# EAGLE design main (EAGLE 6.1)
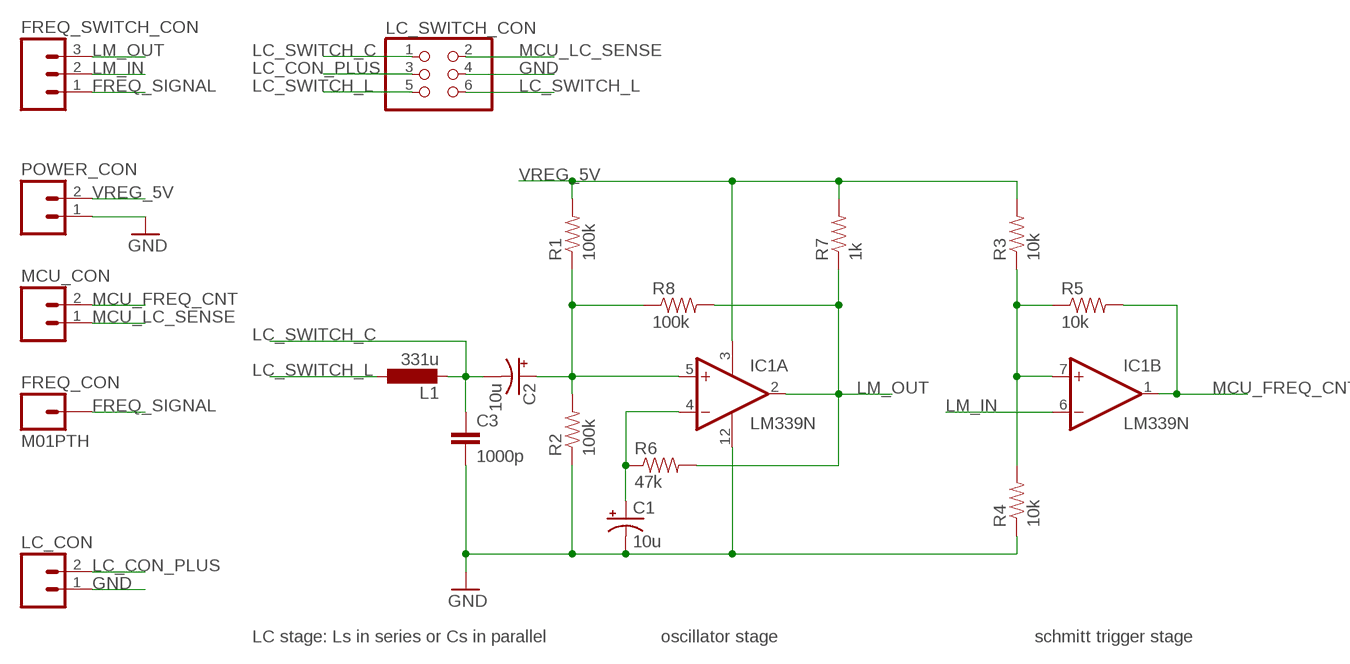
[diagram p0: schematic, sheet 1]

## Parts
C1  10u  CAP_POLPTH1  [CPOL-RADIAL-100UF-25V]
C2  10u  CAP_POLPTH1  [CPOL-RADIAL-100UF-25V]
C3  1000p  CAPKIT  [CAP-PTH-SMALL-KIT]
FREQ_CON  M01PTH  [1X01]
FREQ_SWITCH_CON  M03PTH  [1X03]
IC1  LM339N  [DIL14]
L1  331u  L-EU0207/10  [0207/10]
LC_CON  M02PTH  [1X02]
LC_SWITCH_CON  PINHD-2X3  [2X03]
MCU_CON  M02PTH  [1X02]
POWER_CON  M02PTH  [1X02]
R1  100k  RESISTORPTH-1/4W  [AXIAL-0.4]
R2  100k  RESISTORPTH-1/4W  [AXIAL-0.4]
R3  10k  RESISTORPTH-1/4W  [AXIAL-0.4]
R4  10k  RESISTORPTH-1/4W  [AXIAL-0.4]
R5  10k  RESISTORPTH-1/4W  [AXIAL-0.4]
R6  47k  RESISTORPTH-1/4W  [AXIAL-0.4]
R7  1k  RESISTORPTH-1/4W  [AXIAL-0.4]
R8  100k  RESISTORPTH-1/4W  [AXIAL-0.4]

## Nets
FREQ_SIGNAL: FREQ_CON.1 FREQ_SWITCH_CON.1
GND: C1.2(-) C3.2 IC1.12(P:GND) LC_CON.1 LC_SWITCH_CON.4 POWER_CON.1 R2.P$1 R4.P$1
LC_CON_PLUS: LC_CON.2 LC_SWITCH_CON.3
LC_SWITCH_C: C2.2(-) C3.1 L1.2 LC_SWITCH_CON.1
LC_SWITCH_L: L1.1 LC_SWITCH_CON.5 LC_SWITCH_CON.6
LM_IN: FREQ_SWITCH_CON.2 IC1.6(B:-IN)
LM_OUT: FREQ_SWITCH_CON.3 IC1.2(A:OUT) R6.P$2 R7.P$1 R8.P$2
MCU_FREQ_CNT: IC1.1(B:OUT) MCU_CON.2 R5.P$2
MCU_LC_SENSE: LC_SWITCH_CON.2 MCU_CON.1
N$2: C2.1(+) IC1.5(A:+IN) R1.P$1 R2.P$2 R8.P$1
N$5: C1.1(+) IC1.4(A:-IN) R6.P$1
N$6: IC1.7(B:+IN) R3.P$1 R4.P$2 R5.P$1
VREG_5V: IC1.3(P:V+) POWER_CON.2 R1.P$2 R3.P$2 R7.P$2
Unconnected: IC1.8(C:-IN) IC1.9(C:+IN) IC1.10(D:-IN) IC1.11(D:+IN) IC1.13(D:OUT) IC1.14(C:OUT)

## Notes on the sheet
- LC stage: Ls in series or Cs in parallel | oscillator stage | schmitt trigger stage

## Library data of the parts
C1 C2 = SparkFun:CAP_POL: Capacitor Polarized These are standard SMD and PTH capacitors. Normally 10uF, 47uF, and 100uF in electrolytic and tantalum varieties. Always verify the external diameter of the through hole cap, it varies with capacity, voltage, and manufacturer. The EIA devices should be standard.
C3 = SparkFun:CAP: Capacitor Standard 0603 ceramic capacitor, and 0.1" leaded capacitor.
FREQ_CON = SparkFun:M01: Header 1 Standard 1-pin 0.1" header. Use with straight break away headers (SKU : PRT-00116), right angle break away headers (PRT-00553), swiss pins (PRT-00743), machine pins (PRT-00117), and female headers (PRT-00115).
FREQ_SWITCH_CON = SparkFun:M03: Header 3 Standard 3-pin 0.1" header. Use with straight break away headers (SKU : PRT-00116), right angle break away headers (PRT-00553), swiss pins (PRT-00743), machine pins (PRT-00117), and female headers (PRT-00115). Molex polarized connector foot print use with SKU : PRT-08232 with associated crimp pins and housings.
IC1 = linear:LM339: Low Power Low Offset Voltage Quad Comparators with open collector; LM139/LM239/LM339/LM2901/LM3302
L1 = rcl:L-EU: INDUCTOR, European symbol
LC_CON MCU_CON POWER_CON = SparkFun:M02: Header 2 Standard 2-pin 0.1" header. Use with straight break away headers (SKU : PRT-00116), right angle break away headers (PRT-00553), swiss pins (PRT-00743), machine pins (PRT-00117), and female headers (PRT-00115). Molex polarized connector foot print use with SKU : PRT-08233 with associated crimp pins and housings.
LC_SWITCH_CON = SparkFun:PINHD-2X3: PIN HEADER
R1-R8 = SparkFun:RESISTOR: Resistor Basic schematic elements and footprints for 0603, 1206, and PTH resistors.

## Board
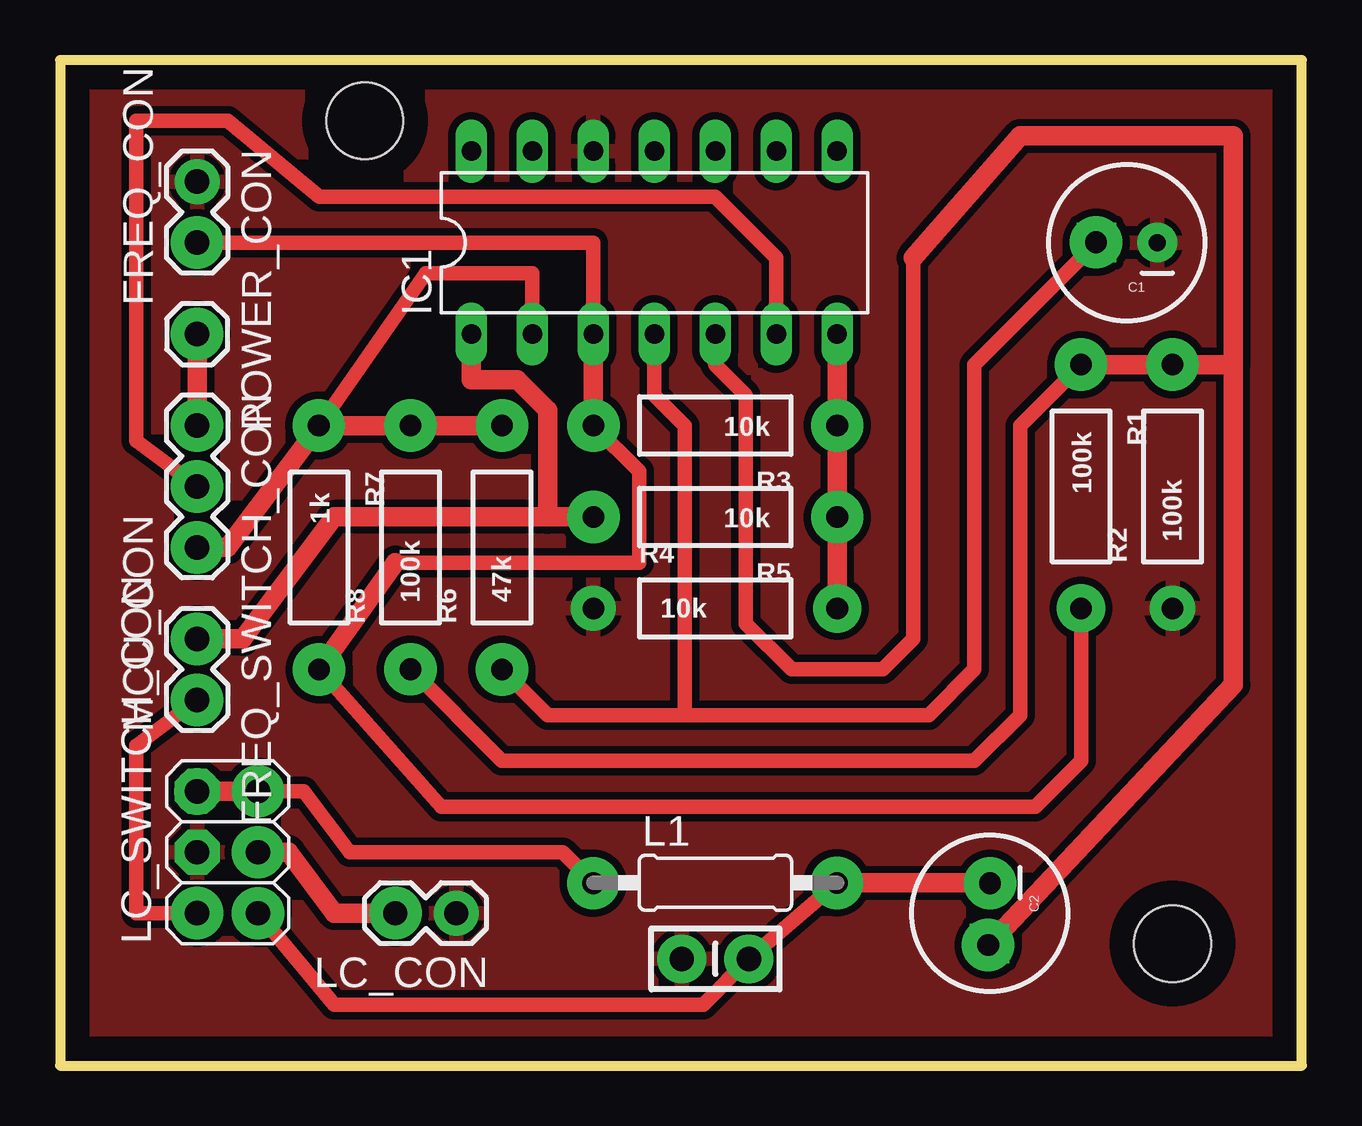
[diagram p1: board, top side]

Size 51.74 x 41.9 mm. Coordinates in mm from the lower left corner, seen from the top.
Outline: 0,0 51.74,0 51.74,41.9 0,41.9 0,0
Copper layers (1*16): Top 0.035mm / dielectric 1.5mm / Bottom 0.035mm
Design rules: minimum track width 10mil, minimum drill 24mil, track to track 8mil, track to pad 8mil, pad to pad 8mil, via to via 8mil, smd to smd 8mil, copper to edge 40mil, drill to drill 8mil, minimum pad ring 10mil, minimum via ring 8mil, stop-mask expansion 4mil, vias tented up to drill 0mil, thermal gap 10mil
Holes 3.2 mm at 46.36,5.08 12.7,39.37

### Footprints (pad centres in the part's own frame; a part is rotated, then mirrored left to right if it is on the bottom)
CPOL-RADIAL-100UF-25V = drill 0.7 pad 1.651 square: 1 1.27,0 | drill 0.7 pad 1.651: 2 -1.27,0
CAP-PTH-SMALL-KIT = drill 1.016 pad 2.032: 1 -1.397,0; 2 1.397,0
1X01 = drill 1.016 pad 1.88: 1 0,0
1X03 = drill 1.016 pad 1.88: 1 0,0; 2 2.54,0; 3 5.08,0
DIL14 = drill 0.813 long: 1 -7.62,-3.81; 2 -5.08,-3.81; 3 -2.54,-3.81; 4 0,-3.81; 5 2.54,-3.81; 6 5.08,-3.81; 7 7.62,-3.81; 8 7.62,3.81; 9 5.08,3.81; 10 2.54,3.81; 11 0,3.81; 12 -2.54,3.81; 13 -5.08,3.81; 14 -7.62,3.81
0207/10 = drill 0.813 octagon: 1 -5.08,0; 2 5.08,0
1X02 = drill 1.016 pad 1.88: 1 0,0; 2 2.54,0
2X03 = drill 1.016 pad 1.88 octagon: 1 -2.54,-1.27; 2 -2.54,1.27; 3 0,-1.27; 4 0,1.27; 5 2.54,-1.27; 6 2.54,1.27
AXIAL-0.4 = drill 0.9 pad 1.88: P$1 -5.08,0; P$2 5.08,0

### Placement (x,y rotation side)
C1  44.45,34.29 180 top
C2  38.73,6.35 270 top
C3  27.3,4.45 180 top
FREQ_CON  5.71,30.48 90 top
FREQ_SWITCH_CON  5.71,26.67 270 top
IC1  24.77,34.29 0 top
L1  27.3,7.62 0 top
LC_CON  16.51,6.35 180 top
LC_SWITCH_CON  6.99,8.89 90 top
MCU_CON  5.71,15.24 90 top
POWER_CON  5.71,36.83 270 top
R1  42.55,24.13 270 top
R2  46.36,24.13 90 top
R3  27.3,26.67 180 top
R4  27.3,19.05 0 top
R5  27.3,22.86 180 top
R6  18.42,21.59 90 top
R7  10.79,21.59 270 top
R8  14.6,21.59 90 top

### Tracks (layer width: path | path; a pad name or v marks a point on that pad's centre or on a via)
FREQ_SIGNAL
  Top 0.813: FREQ_CON.1 FREQ_SWITCH_CON.1
GND
  pour Top (isolate 0.305): 0,41.91 52.07,41.91 52.07,0 0,0
LC_CON_PLUS
  Top 0.813: LC_CON.2 11.43,6.35 9.53,8.89 LC_SWITCH_CON.3
LC_SWITCH_C
  Top 0.61: LC_SWITCH_CON.1 11.43,2.54 26.8,2.54 C3.1 L1.2
  Top 0.813: L1.2 C2.2
LC_SWITCH_L
  Top 0.61: LC_SWITCH_CON.5 10.16,11.43 12.06,8.89 20.96,8.89 L1.1
  Top 0.813: LC_SWITCH_CON.5 LC_SWITCH_CON.6
LM_IN
  Top 0.61: IC1.6 29.85,33.66 27.3,36.2 10.79,36.2 6.99,39.37 3.17,39.37 3.17,26.04 FREQ_SWITCH_CON.2
LM_OUT
  Top 0.61: IC1.2 19.69,33.02 15.24,33.02 R7.P$1
  Top 0.813: R6.P$2 R8.P$2 R7.P$1 6.99,21.59 FREQ_SWITCH_CON.3
MCU_FREQ_CNT
  Top 0.813: R5.P$2 20.32,22.86 | 20.32,22.86 11.43,22.86 7.62,17.78 MCU_CON.2 | IC1.1 17.14,28.57 19.05,28.57 20.32,27.3 20.32,22.86
MCU_LC_SENSE
  Top 0.61: MCU_CON.1 3.17,13.34 3.17,6.35 LC_SWITCH_CON.2
N$2
  Top 0.61: R1.P$1 40.01,26.67 40.01,14.61 38.1,12.7 18.42,12.7 R8.P$1 | IC1.5 27.3,29.21 28.58,27.94 28.58,18.41 30.48,16.51 34.29,16.51 35.56,17.78 35.56,33.66
  Top 0.813: R1.P$1 R2.P$2 48.9,29.21 | C2.1 48.9,15.88 48.9,29.21 | 35.56,33.66 40.01,38.73 48.9,38.73 48.9,29.21
N$3  (via drill 1.01 pad 2.18)
  other vias: 5.71,34.29
N$4  (via drill 1.01 pad 2.18)
  other vias: 5.71,30.48
N$5
  Top 0.61: R6.P$1 20.32,14.61 26.04,14.61 | 26.04,14.61 26.04,26.67 24.77,27.94 IC1.4 | C1.1 38.1,29.21 38.1,16.51 36.2,14.61 26.04,14.61
N$6
  Top 0.813: R4.P$2 R5.P$1 R3.P$1 IC1.7
N$7  (via drill 1.01 pad 2.18)
  other vias: 5.71,26.67
N$8  (via drill 1.01 pad 2.18)
  other vias: 5.72,24.13
N$9  (via drill 1.01 pad 2.18)
  other vias: 5.71,21.59
N$10  (via drill 1.01 pad 2.18)
  other vias: 5.72,17.78
N$11  (via drill 1.01 pad 2.18)
  other vias: 5.72,15.24
N$12  (via drill 1.01 pad 1.93)
  other vias: 5.72,11.43
N$13  (via drill 1.01 pad 2.18)
  other vias: 8.26,11.43
N$15  (via drill 1.01 pad 2.18)
  other vias: 8.25,8.89
N$16  (via drill 1.01 pad 2.18)
  other vias: 5.72,6.35
N$17  (via drill 1.01 pad 2.18)
  other vias: 8.25,6.35
N$18  (via drill 1.01 pad 2.18)
  other vias: 13.97,6.35
N$20  (via drill 0.9 pad 2.18)
  other vias: 43.17,34.31
N$22  (via drill 0.9 pad 2.18)
  other vias: 46.36,29.21
N$23  (via drill 0.9 pad 2.18)
  other vias: 42.54,29.21
N$24  (via drill 0.9 pad 2.18)
  other vias: 10.78,26.67
N$25  (via drill 0.9 pad 2.18)
  other vias: 14.61,26.67
N$26  (via drill 0.9 pad 2.18)
  other vias: 18.42,26.67
N$27  (via drill 0.9 pad 2.18)
  other vias: 22.22,26.67
N$28  (via drill 0.9 pad 2.18)
  other vias: 32.39,26.67
N$29  (via drill 0.9 pad 2.18)
  other vias: 22.23,22.86
N$30  (via drill 0.9 pad 2.18)
  other vias: 32.39,22.86
N$31  (via drill 0.9 pad 2.01)
  other vias: 32.39,19.04
N$33  (via drill 0.9 pad 2.18)
  other vias: 10.79,16.5
N$34  (via drill 0.9 pad 2.18)
  other vias: 14.6,16.52
N$35  (via drill 0.9 pad 2.18)
  other vias: 18.41,16.51
N$36  (via drill 0.9 pad 2.18)
  other vias: 22.22,7.6
N$37  (via drill 0.9 pad 2.18)
  other vias: 32.37,7.61
N$38  (via drill 0.9 pad 2.18)
  other vias: 38.75,7.6
N$39  (via drill 0.9 pad 2.18)
  other vias: 38.68,5.02
N$40  (via drill 0.9 pad 2.01)
  other vias: 42.54,19.05
VREG_5V
  Top 0.61: POWER_CON.2 22.23,34.29 IC1.3 | R1.P$2 42.55,12.7 40.64,10.8 15.88,10.8 R7.P$2 | 13.97,20.95 24.13,20.95 24.13,24.77 R3.P$2
  Top 0.813: R7.P$2 13.97,20.95 | IC1.3 R3.P$2